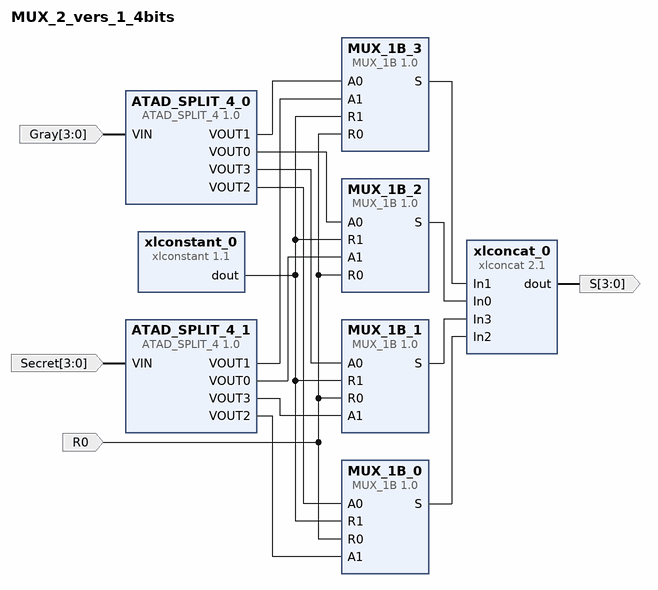
[diagram p0: block diagram of the top level]
# Vivado block design MUX_2_vers_1_4bits, xc7a100tcsg324-1, Vivado 2018.3
create_bd_design MUX_2_vers_1_4bits

create_bd_port -dir I -from 3 -to 0 Gray
create_bd_port -dir I -from 3 -to 0 Secret
create_bd_port -dir I R0
create_bd_port -dir O -from 3 -to 0 S

create_bd_cell -type ip -vlnv xilinx.com:ip:xlconstant:1.1 xlconstant_0
set_property -dict {CONFIG.CONST_VAL 0} [get_bd_cells xlconstant_0]
create_bd_cell -type ip -vlnv xilinx.com:ip:xlconcat:2.1 xlconcat_0
set_property -dict {CONFIG.NUM_PORTS 4} [get_bd_cells xlconcat_0]
create_bd_cell -type ip -vlnv xilinx.com:user:ATAD_SPLIT_4:1.0 ATAD_SPLIT_4_0
create_bd_cell -type ip -vlnv xilinx.com:user:ATAD_SPLIT_4:1.0 ATAD_SPLIT_4_1
create_bd_cell -type ip -vlnv xilinx.com:user:MUX_1B:1.0 MUX_1B_0
create_bd_cell -type ip -vlnv xilinx.com:user:MUX_1B:1.0 MUX_1B_1
create_bd_cell -type ip -vlnv xilinx.com:user:MUX_1B:1.0 MUX_1B_2
create_bd_cell -type ip -vlnv xilinx.com:user:MUX_1B:1.0 MUX_1B_3

# ---- connections ----

connect_bd_net -net R0_1 [get_bd_ports R0] [get_bd_pins MUX_1B_0/R0] [get_bd_pins MUX_1B_1/R0] [get_bd_pins MUX_1B_2/R0] [get_bd_pins MUX_1B_3/R0]
connect_bd_net [get_bd_pins xlconstant_0/dout] [get_bd_pins MUX_1B_0/R1] [get_bd_pins MUX_1B_1/R1] [get_bd_pins MUX_1B_2/R1] [get_bd_pins MUX_1B_3/R1]
connect_bd_net [get_bd_pins MUX_1B_2/S] [get_bd_pins xlconcat_0/In0]
connect_bd_net [get_bd_pins MUX_1B_3/S] [get_bd_pins xlconcat_0/In1]
connect_bd_net [get_bd_pins MUX_1B_0/S] [get_bd_pins xlconcat_0/In2]
connect_bd_net [get_bd_pins MUX_1B_1/S] [get_bd_pins xlconcat_0/In3]
connect_bd_net [get_bd_pins xlconcat_0/dout] [get_bd_ports S]
connect_bd_net [get_bd_ports Gray] [get_bd_pins ATAD_SPLIT_4_0/VIN]
connect_bd_net [get_bd_ports Secret] [get_bd_pins ATAD_SPLIT_4_1/VIN]
connect_bd_net [get_bd_pins ATAD_SPLIT_4_0/VOUT0] [get_bd_pins MUX_1B_2/A0]
connect_bd_net [get_bd_pins ATAD_SPLIT_4_0/VOUT1] [get_bd_pins MUX_1B_3/A0]
connect_bd_net [get_bd_pins ATAD_SPLIT_4_0/VOUT2] [get_bd_pins MUX_1B_0/A0]
connect_bd_net [get_bd_pins ATAD_SPLIT_4_0/VOUT3] [get_bd_pins MUX_1B_1/A0]
connect_bd_net [get_bd_pins ATAD_SPLIT_4_1/VOUT0] [get_bd_pins MUX_1B_2/A1]
connect_bd_net [get_bd_pins ATAD_SPLIT_4_1/VOUT1] [get_bd_pins MUX_1B_3/A1]
connect_bd_net [get_bd_pins ATAD_SPLIT_4_1/VOUT2] [get_bd_pins MUX_1B_0/A1]
connect_bd_net [get_bd_pins ATAD_SPLIT_4_1/VOUT3] [get_bd_pins MUX_1B_1/A1]

validate_bd_design
save_bd_design
